# Altium project mcc_dac_amp.PrjPcb
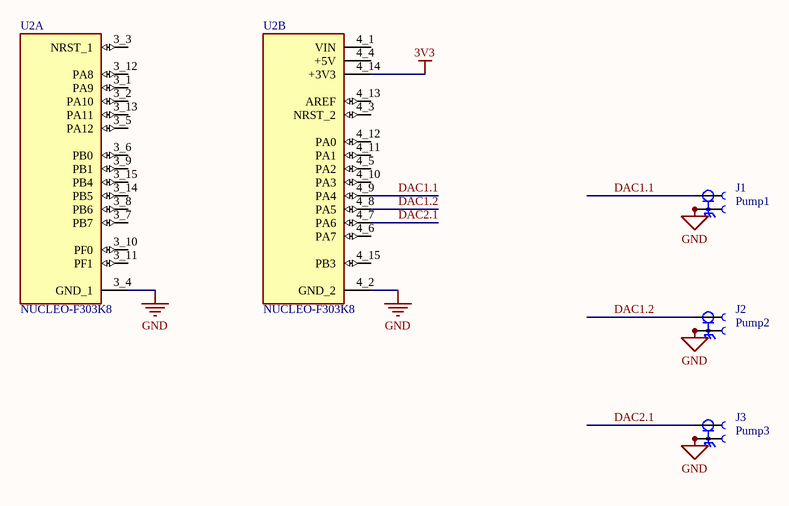
[diagram p0: mcc_dac_amp.SchDoc]
1 sheet, 4 parts. Net scope: global (net labels, ports and power ports of the same name join across sheets).
Board file: mcc_dac_amp.PcbDoc

## Sheet mcc_dac_amp.SchDoc
size B; SheetNumber: 1; SheetTotal: 1

### Parts
J1  Pump1  [LINX_CONBNC002]
J2  Pump2  [LINX_CONBNC002]
J3  Pump3  [LINX_CONBNC002]
U2  NUCLEO-F303K8  [MODULE_NUCLEO-F303K8]  (parts A,B of 2)

### Nets
3V3: U2.4_14(+3V3)
GND: J1.2 J1.S1 J1.S2 J2.2 J2.S1 J2.S2 J3.2 J3.S1 J3.S2 U2.3_4(GND_1) U2.4_2(GND_2)
DAC1.1: J1.1 U2.4_9(PA4)
DAC1.2: J2.1 U2.4_8(PA5)
DAC2.1: J3.1 U2.4_7(PA6)

Not connected (* = marked no-connect by the designer): U2 3_1(PA9) 3_2(PA10) 3_3(NRST_1) 3_5(PA12) 3_6(PB0) 3_7(PB7) 3_8(PB6) 3_9(PB1) 3_10(PF0) 3_11(PF1) 3_12(PA8) 3_13(PA11) 3_14(PB5) 3_15(PB4) 4_1(VIN) 4_3(NRST_2) 4_4(+5V) 4_5(PA2) 4_6(PA7) 4_10(PA3) 4_11(PA1) 4_12(PA0) 4_13(AREF) 4_15(PB3)

### Library data of the parts
J1-J3 = CONBNC002: MF: {'manufacturer': u'TE Connectivity'}; Package: None; Price: None; Value: *; MP: CONBNC002; Availability: Unavailable
U2 = NUCLEO-F303K8: MF: {'manufacturer': u'STMicroelectronics'}; Package: None; Price: None; Value: *; MP: NUCLEO-F303K8; Availability: Unavailable